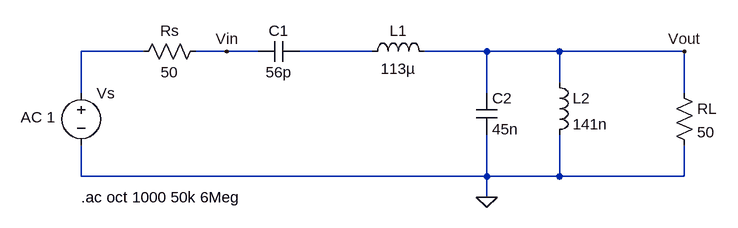
[diagram p0: schematic ButterworthBandPass.asc]
ButterworthBandPass.asc, the LTspice schematic file:
Version 4
SHEET 1 880 680
WIRE -32 48 -128 48
WIRE 96 48 48 48
WIRE 144 48 96 48
WIRE 320 48 208 48
WIRE 496 48 400 48
WIRE 608 48 496 48
WIRE 800 48 608 48
WIRE 608 96 608 48
WIRE -128 112 -128 48
WIRE 496 112 496 48
WIRE 800 112 800 48
WIRE -128 240 -128 192
WIRE 496 240 496 176
WIRE 496 240 -128 240
WIRE 608 240 608 176
WIRE 608 240 496 240
WIRE 800 240 800 192
WIRE 800 240 608 240
WIRE 496 272 496 240
FLAG 496 272 0
FLAG 800 48 Vout
FLAG 96 48 Vin
SYMBOL voltage -128 96 R0
WINDOW 3 24 44 Left 2
WINDOW 123 -93 53 Left 2
WINDOW 39 0 0 Left 2
SYMATTR InstName Vs
SYMATTR Value ""
SYMATTR Value2 AC 1
SYMBOL res 64 32 R90
WINDOW 0 0 56 VBottom 2
WINDOW 3 32 56 VTop 2
SYMATTR InstName Rs
SYMATTR Value 50
SYMBOL res 784 96 R0
SYMATTR InstName RL
SYMATTR Value 50
SYMBOL ind 304 64 R270
WINDOW 0 32 56 VTop 2
WINDOW 3 5 56 VBottom 2
SYMATTR InstName L1
SYMATTR Value 113µ
SYMBOL cap 480 112 R0
SYMATTR InstName C2
SYMATTR Value 45n
SYMBOL ind 592 80 R0
SYMATTR InstName L2
SYMATTR Value 141n
SYMBOL cap 208 32 R90
WINDOW 0 0 32 VBottom 2
WINDOW 3 32 32 VTop 2
SYMATTR InstName C1
SYMATTR Value 56p
TEXT -128 272 Left 2 !.ac oct 1000 50k 6Meg

The netlist it stands for:
* ButterworthBandPass.asc
Vs N001 0 AC 1
Rs Vin N001 50
RL Vout 0 50
L1 N002 Vout 113µ
C2 Vout 0 45n
L2 Vout 0 141n
C1 N002 Vin 56p
.ac oct 1000 50k 6Meg
.backanno
.end

* Results of the author's LTspice run, read from the files saved beside the schematic
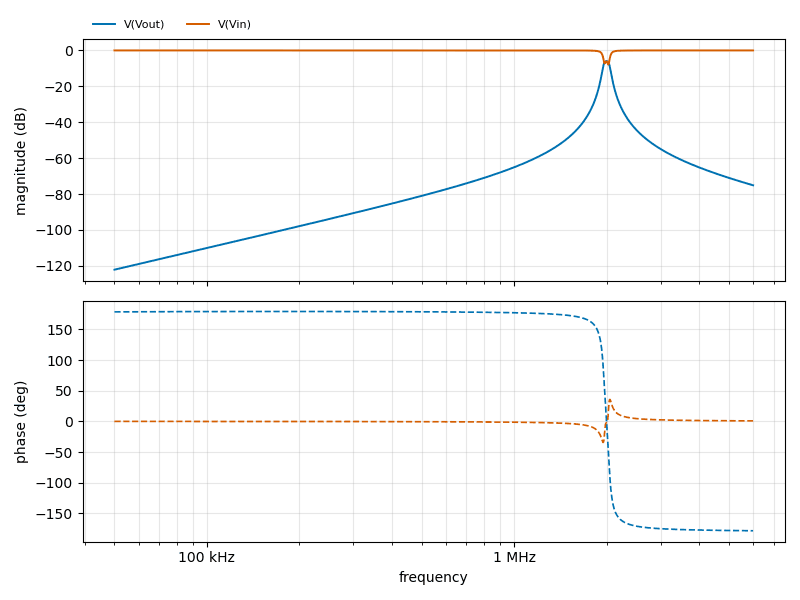
[diagram p1: AC Analysis of ButterworthBandPass.asc, plotted from the saved traces]
* AC Analysis, 1 run:
*   V(Vout): -122.15 dB at 50 kHz, -75.13 dB at 6 MHz, peak -6.10 dB at 2.001 MHz, 3 dB below the peak at 1.95 MHz and 2.05 MHz
*   V(Vin): -0.00 dB at 50 kHz, -0.00 dB at 6 MHz, peak -0.00 dB at 50 kHz, 3 dB below the peak at 1.943 MHz